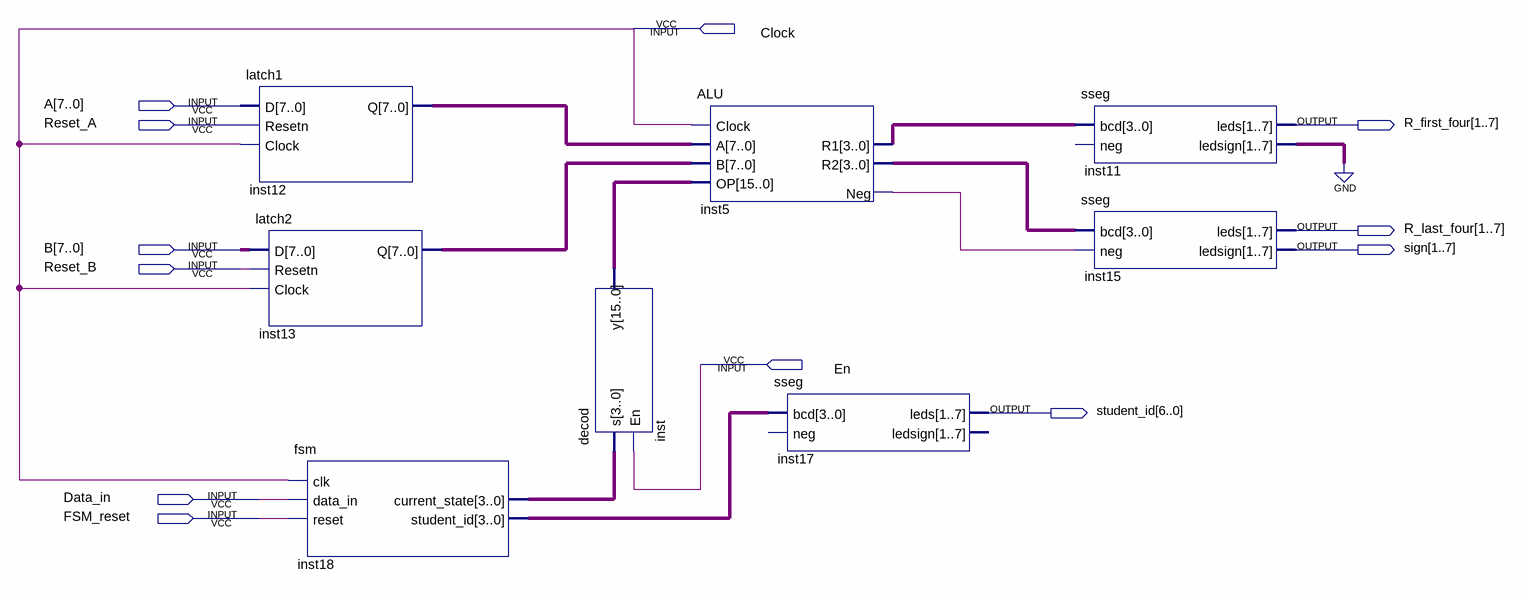
[diagram p0: schematic sheet]
// Quartus schematic GPUpart1.bdf as structural Verilog: 8 symbols, 12 pins
module GPUpart1 (
  input  Clock,
  input  [7:0] A,
  input  Reset_A,
  input  [7:0] B,
  input  Reset_B,
  input  En,
  input  Data_in,
  input  FSM_reset,
  output [1:7] R_first_four,
  output [1:7] R_last_four,
  output [1:7] sign,
  output [6:0] student_id
);

  wire inst5_neg;
  wire [3:0] inst5_r1, inst5_r2, inst18_current_state, inst18_student_id;
  wire [6:0] inst11_ledsign;
  wire [7:0] inst12_q, inst13_q;
  wire [15:0] inst_y;

  latch1 inst12 (.D(A), .Resetn(Reset_A), .Clock(Clock), .Q(inst12_q));
  latch2 inst13 (.D(B), .Resetn(Reset_B), .Clock(Clock), .Q(inst13_q));
  fsm inst18 (
    .clk(Clock), .data_in(Data_in), .reset(FSM_reset), .student_id(inst18_student_id),
    .current_state(inst18_current_state));
  decod inst (.s(inst18_current_state), .En(En), .y(inst_y));
  ALU inst5 (.Clock(Clock), .A(inst12_q), .B(inst13_q), .OP(inst_y), .Neg(inst5_neg), .R1(inst5_r1), .R2(inst5_r2));
  sseg inst17 (.bcd(inst18_student_id), .leds(student_id));  // open: neg, ledsign
  sseg inst11 (.bcd(inst5_r1), .leds(R_first_four), .ledsign(inst11_ledsign));  // open: neg
  sseg inst15 (.bcd(inst5_r2), .neg(inst5_neg), .leds(R_last_four), .ledsign(sign));
  // also tied to GND on the sheet: {inst11_ledsign[0], inst11_ledsign[1], inst11_ledsign[2], inst11_ledsign[3], inst11_ledsign[4], inst11_ledsign[5], inst11_ledsign[6]}
endmodule
